# EAGLE schematic counter_shield (EAGLE 6.4)
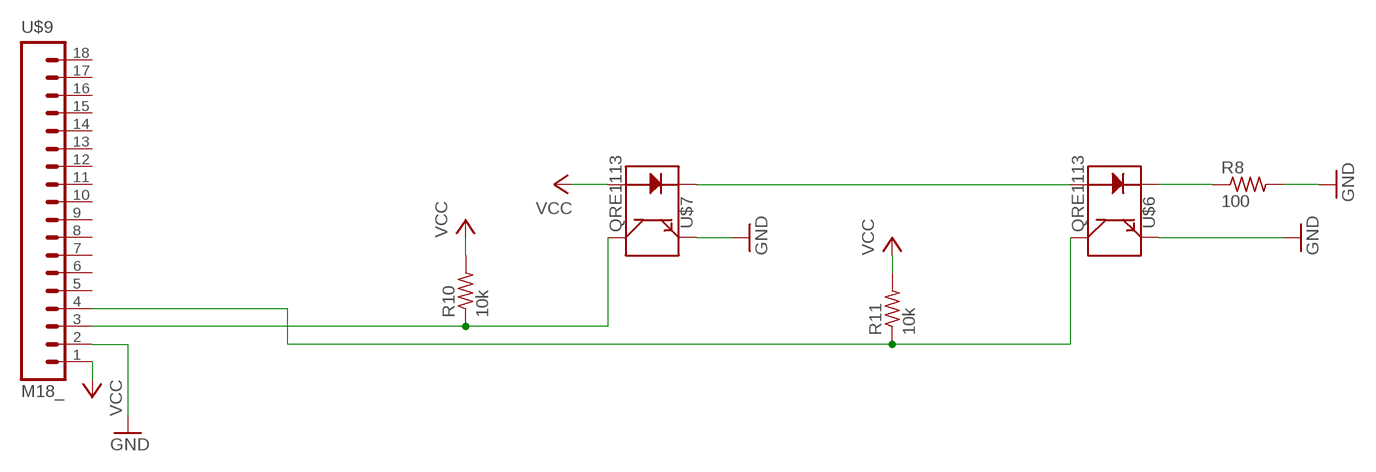
[diagram p0: schematic, sheet 1]

## Parts
R8  100  RESISTOR1206  [1206]
R10  10k  RESISTOR1206  [1206]
R11  10k  RESISTOR1206  [1206]
U$6  QRE1113  [QRE1113]
U$7  QRE1113  [QRE1113]
U$9  M18_  [1X18]

## Nets
GND: R8.2 U$6.4(E) U$7.4(E) U$9.2
N$10: R8.1 U$6.2(K)
N$11: U$6.1(A) U$7.2(K)
N$12: R10.1 U$7.3(C) U$9.3
N$13: R11.1 U$6.3(C) U$9.4
VCC: R10.2 R11.2 U$7.1(A) U$9.1
Unconnected: U$9.5 U$9.6 U$9.7 U$9.8 U$9.9 U$9.10 U$9.11 U$9.12 U$9.13 U$9.14 U$9.15 U$9.16 U$9.17 U$9.18

## Library data of the parts
R8 R10 R11 = 01_ng:RESISTOR
U$6 U$7 = SparkFun-Sensors:QRE1113: Reflective object sensor
U$9 = SparkFun-Connectors:M18: 1x18 .1" header